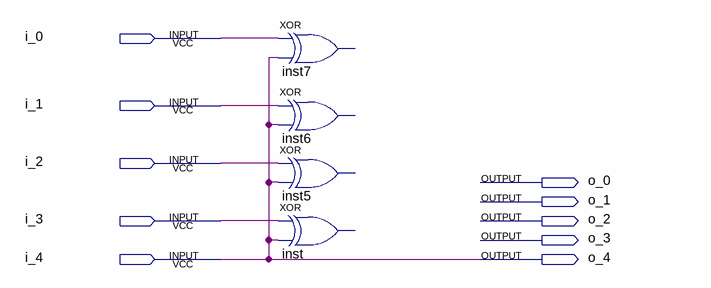
[diagram p0: schematic sheet]
// Quartus schematic complemento_sinal.bdf as structural Verilog: 4 symbols, 10 pins
module complemento_sinal (
  input  i_0,
  input  i_1,
  input  i_2,
  input  i_3,
  input  i_4,
  output o_0,
  output o_1,
  output o_2,
  output o_3,
  output o_4
);

  // XOR inst7 has open pins: IN1=i_0, IN2=i_4, OUT=open
  // XOR inst6 has open pins: IN1=i_1, IN2=i_4, OUT=open
  // XOR inst5 has open pins: IN1=i_2, IN2=i_4, OUT=open
  // XOR inst has open pins: IN1=i_3, IN2=i_4, OUT=open

  assign o_4 = i_4;
endmodule
